# EAGLE design chyba gotowe nowe (EAGLE 9.6.2)
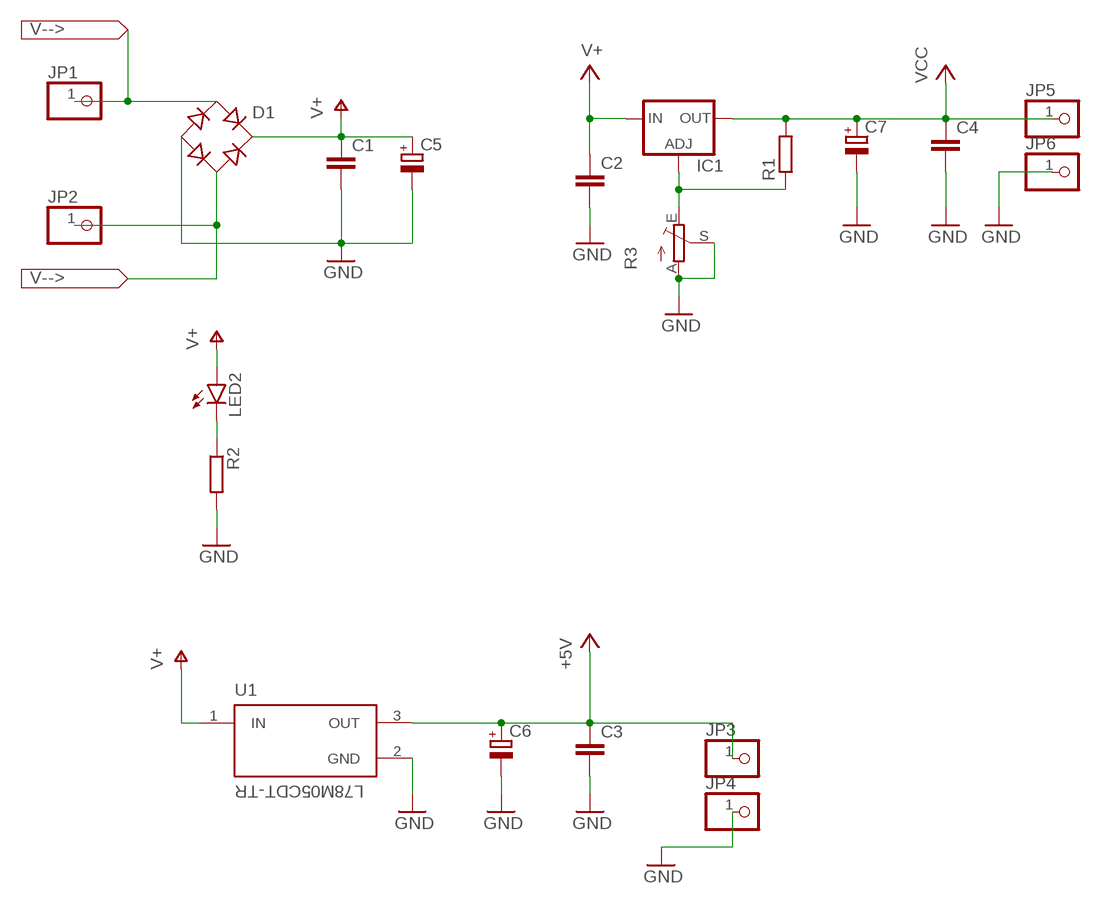
[diagram p0: schematic, sheet 1]

## Parts
C1  C-EUC1206  [C1206]
C2  C-EUC1206  [C1206]
C3  C-EUC1206  [C1206]
C4  C-EUC1206  [C1206]
C5  CPOL-EUTT5D10  [TT5D10]
C6  CPOL-EUTT5D10  [TT5D10]
C7  CPOL-EUTT5D10  [TT5D10]
D1  RECTIFIER-RB1A  [RB1A]
IC1  LM317MSTT3  [SOT223]
JP1  PINHD-1X1  [1X01]
JP2  PINHD-1X1  [1X01]
JP3  PINHD-1X1  [1X01]
JP4  PINHD-1X1  [1X01]
JP5  PINHD-1X1  [1X01]
JP6  PINHD-1X1  [1X01]
LED2  LEDSMT1206  [1206]
R1  R-EU_R1206  [R1206]
R2  R-EU_R1206  [R1206]
R3  TRIM_EU-PT10  [PT-10]
U1  L78M05CDT-TR  [VREG_L78M05CDT-TR]

## Nets
+5V [2mm]: C3.1 C6.+ JP3.1 U1.3(OUT)
GND: C1.2 C2.2 C3.2 C4.2 C5.- C6.- C7.- D1.- JP4.1 JP6.1 R2.2 R3.A R3.S U1.2(GND)
N$1: LED2.C R2.1
N$2: D1.AC1 JP1.1
N$3: D1.AC2 JP2.1
N$4: IC1.1(ADJ) R1.1 R3.E
V+ [2mm]: C1.1 C2.1 C5.+ D1.+ IC1.3(IN) LED2.A U1.1(IN)
VCC [2mm]: C4.1 C7.+ IC1.4(OUT) JP5.1 R1.2

## Library data of the parts
C1-C4 = rcl:C-EU: CAPACITOR, European symbol; SPICEPREFIX: C
C5-C7 = rcl:CPOL-EU: POLARIZED CAPACITOR, European symbol; SPICEPREFIX: C
D1 = rectifier:RECTIFIER-: Rectifier
IC1 = v-reg:LM317?*: 500 mA Adjustable Output Positive Voltage Regulator Source: http://www.onsemi.co.jp .. LM317M-D.PDF
JP1-JP6 = pinhead:PINHD-1X1: PIN HEADER
LED2 = led:LED: LED OSRAM: - CHIPLED LG R971, LG N971, LY N971, LG Q971, LY Q971, LO R971, LY R971 LH N974, LH R974 LS Q976, LO Q976, LY Q976 LO Q996 - Hyper CHIPLED LW Q18S LB Q993, LB Q99A, LB R99A - SideLED LS A670, LO A670, LY A670, LG A670, LP A670 LB A673, LV A673, LT A673, LW A673 LH A674 LY A675 LS A676, LA A676, LO A676, LY A676, LW A676 LS A679, LY A679, LG A679 - Hyper Micro SIDELED® LS Y876, LA Y876, LO Y876, LY Y876 LT Y87S - SmartLED LW L88C, LW L88S LB L89C, LB L89S, LG L890 LS L89K, LO L89K, LY L89K LS L896, LA L896, LO L896, LY L896 - TOPLED LS T670, LO T670, LY T670, LG T670, LP T670 LSG T670, LSP T670, LSY T670, LOP T670, LYG T670 LG T671, LOG T671, LSG T671 LB T673, LV T673, LT T673, LW T673 LH T674 LS T676, LA T676, LO T676, LY T676, LB T676, LH T676, LSB T676, LW T676 LB T67C, LV T67C, LT T67C, LS T67K, LO T67K, LY T67K, LW E67C LS E67B, LA E67B, LO E67B, LY E67B, LB E67C, LV E67C, LT E67C LW T67C LS T679, LY T679, LG T679 LS T770, LO T770, LY T770, LG T770, LP T770 LB T773, LV T773, LT T773, LW T773 LH T774 LS E675, LA E675, LY E675, LS T675 LS T776, LA T776, LO T776, LY T776, LB T776 LHGB T686 LT T68C, LB T68C - Hyper Mini TOPLED® LB M676 - Mini TOPLED Santana® LG M470 LS M47K, LO M47K, LY M47K Source: http://www.osram.convergy.de LUXEON: - LUMILED® LXK2-PW12-R00, LXK2-PW12-S00, LXK2-PW14-U00, LXK2-PW14-V00 LXK2-PM12-R00, LXK2-PM12-S00, LXK2-PM14-U00 LXK2-PE12-Q00, LXK2-PE12-R00, LXK2-PE12-S00, LXK2-PE14-T00, LXK2-PE14-U00 LXK2-PB12-K00, LXK2-PB12-L00, LXK2-PB12-M00, LXK2-PB14-N00, LXK2-PB14-P00, LXK2-PB14-Q00 LXK2-PR12-L00, LXK2-PR12-M00, LXK2-PR14-Q00, LXK2-PR14-R00 LXK2-PD12-Q00, LXK2-PD12-R00, LXK2-PD12-S00 LXK2-PH12-R00, LXK2-PH12-S00 LXK2-PL12-P00, LXK2-PL12-Q00, LXK2-PL12-R00 Source: www.luxeon.com KINGBRIGHT: KA-3528ASYC Source: www.kingbright.com
R1 R2 = rcl:R-EU_: RESISTOR, European symbol; SPICEPREFIX: R
R3 = pot:TRIM_EU-: POTENTIOMETER
U1 = L78M05CDT-TR:L78M05CDT-TR: Linear Voltage Regulator IC 1 Output 500mA DPAK; MANUFACTURER: STMicroelectronics; MAXIMUM_PACKAGE_HEIGHT: 2.4 mm; PARTREV: 24; STANDARD: Manufacturer Recommendations

## Net classes
0 default: width 0.5 mm
1 2mm: width 2 mm

## Board
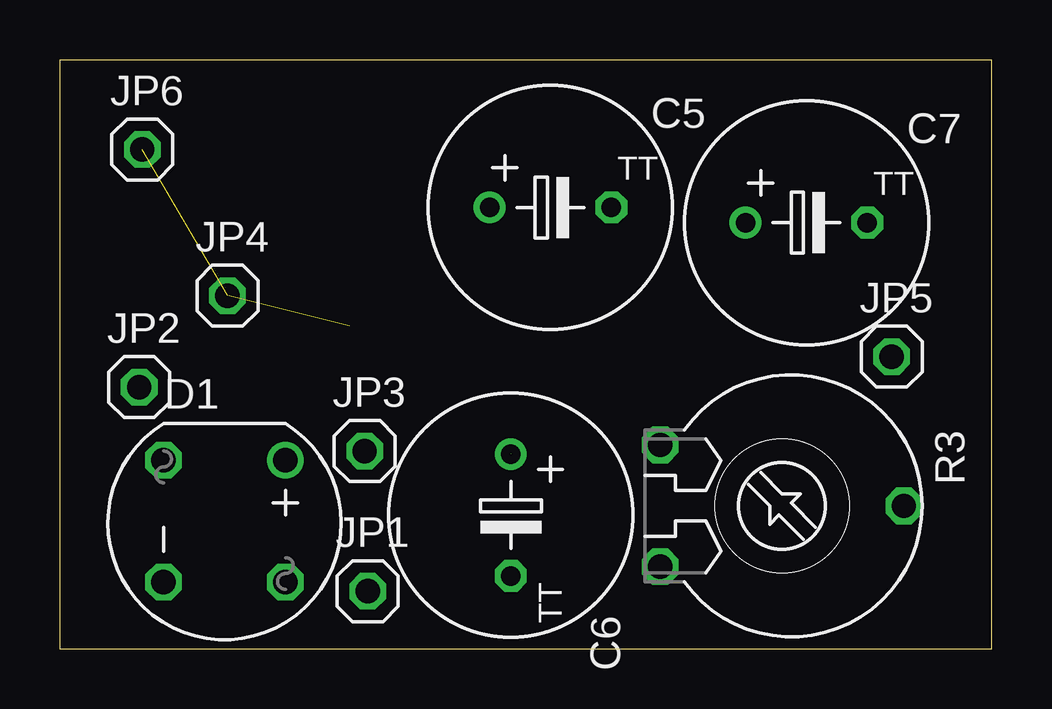
[diagram p1: board, top side]
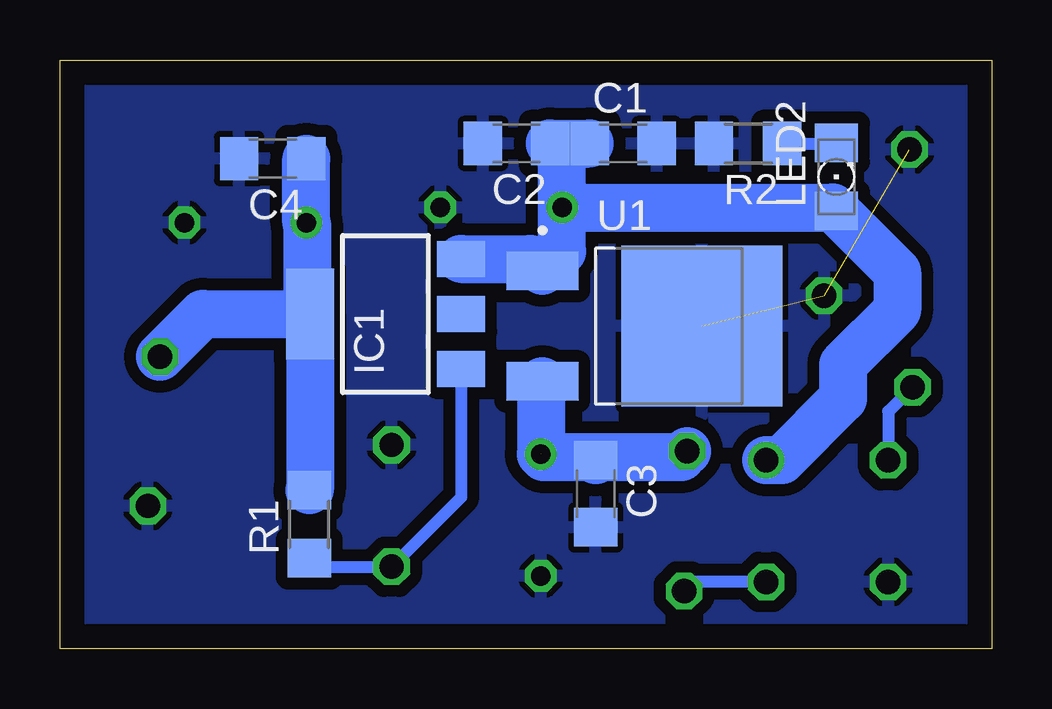
[diagram p2: board, bottom side, seen from below]

Size 38.84 x 24.56 mm. Coordinates in mm from the lower left corner, seen from the top.
Outline: 0,0 38.84,0 38.84,24.56 0,24.56 0,0
Copper layers (1*16): Top 0.035mm / dielectric 1.5mm / Bottom 0.035mm
Design rules "default *": minimum track width 6mil, minimum drill 0.35mm, track to track 0.5mm, track to pad 0.5mm, pad to pad 6mil, via to via 6mil, smd to smd 6mil, copper to edge 40mil, drill to drill 6mil, minimum pad ring 10mil, minimum via ring 8mil, stop-mask expansion 4mil, vias tented up to drill 0mil, thermal gap 10mil

### Footprints (pad centres in the part's own frame; a part is rotated, then mirrored left to right if it is on the bottom)
C1206 = smd 1.6 x 1.8: 1 -1.4,0; 2 1.4,0
TT5D10 = drill 0.813: + -2.54,0 | drill 0.813 octagon: - 2.54,0
RB1A = drill 1.016: + -2.54,2.54 | drill 1.016 octagon: - 2.54,-2.54; AC1 2.54,2.54; AC2 -2.54,-2.54
SOT223 = smd 1.5 x 2: 1 -2.3,-3.15; 2 0,-3.15; 3 2.3,-3.15 | smd 3.8 x 2: 4 0,3.15
1X01 = drill 1.016 octagon: 1 0,0
1206 = smd 1.6 x 1.803: A -1.422,0; C 1.422,0
R1206 = smd 1.6 x 1.803: 1 -1.422,0; 2 1.422,0
PT-10 = drill 1.016 octagon: A -2.54,-5.08; E 2.54,-5.08; S 0,5.08
VREG_L78M05CDT-TR = smd 3 x 1.6: 1 -4.25,2.3; 3 -4.25,-2.3 | smd 6.7 x 6.7: 2 2.4,0

### Placement (x,y rotation side)
C1  15.37,21.08 0 bottom
C2  19.81,21.08 180 bottom
C3  16.51,6.48 270 bottom
C4  29.97,20.45 180 bottom
C5  20.45,18.41 0 top
C6  18.8,5.59 270 top
C7  31.12,17.78 0 top
D1  6.86,5.33 270 top
IC1  25.27,13.97 90 bottom
JP1  12.83,2.41 0 top
JP2  3.3,10.92 0 top
JP3  12.7,8.26 0 top
JP4  6.98,14.73 0 top
JP5  34.67,12.19 0 top
JP6  3.43,20.83 0 top
LED2  6.48,19.69 90 bottom
R1  28.45,5.21 90 bottom
R2  10.16,21.08 180 bottom
R3  30.1,5.97 270 top
U1  14.48,13.46 0 bottom

### Tracks (layer width: path | path; a pad name or v marks a point on that pad's centre or on a via)
+5V  (1 unrouted)
  Bottom 2: C6.+ 18.67,8 16.64,8 | 16.64,8 12.95,8 JP3.1 | U1.3 18.8,11.09 C6.+ | C3.1 16.64,8
GND  (2 unrouted)
  pour Bottom: 0.13,25.4 39.5,25.4 39.5,-1.27 -1.14,-1.27 -1.14,24.13
N$1
  Bottom 0.5: R2.1 6.5,21.08 LED2.C
N$2
  Bottom 0.508: D1.AC1 12.45,2.79 JP1.1
N$3
  Bottom 0.508: JP2.1 4.32,9.91 D1.AC2
N$4
  Bottom 0.5: IC1.1 22.12,6.33 R3.E
  Bottom 0.508: IC1.1 21.72,11.26 | R1.1 28.09,3.43 R3.E
V+
  Bottom 2: C2.1 | C2.1 C1.1 | IC1.3 19.24,16.27 U1.1 17.91,16.58 C5.+ | C5.+ 17.91,20.58 C2.1 | C5.+ 6.63,18.41 LED2.A 3.94,15.72 3.94,14.12 6.2,11.86 6.2,10.44 8.76,7.87 D1.+
VCC
  Bottom 2: JP5.1 32.89,13.97 IC1.4 | IC1.4 28.42,6.65 R1.2 | IC1.4 28.55,14.1 28.55,17.76 C7.+ C4.1